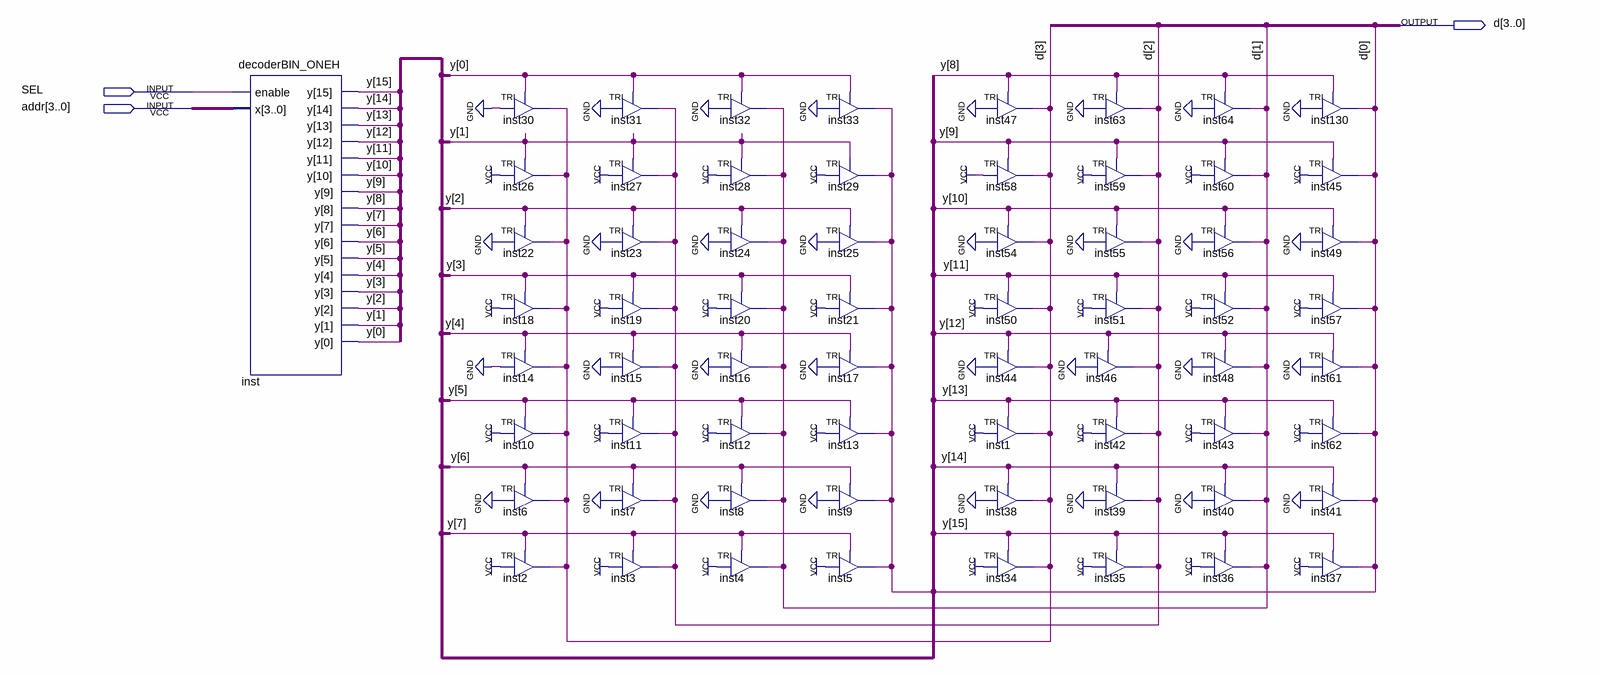
[diagram p0: schematic sheet]
// Quartus schematic rom16x4_0ls.bdf as structural Verilog: 65 symbols, 3 pins
module rom16x4_0ls (
  input  SEL,
  input  [3:0] addr,
  output [3:0] d
);

  wire [15:0] y;

  decoderBIN_ONEH inst (.enable(SEL), .x(addr), .y(y));
  TRI inst30 (.IN(1'b0), .OE(y[0]), .OUT(d[3]));
  TRI inst26 (.IN(1'b1), .OE(y[1]), .OUT(d[3]));
  TRI inst22 (.IN(1'b0), .OE(y[2]), .OUT(d[3]));
  TRI inst18 (.IN(1'b1), .OE(y[3]), .OUT(d[3]));
  TRI inst14 (.IN(1'b0), .OE(y[4]), .OUT(d[3]));
  TRI inst10 (.IN(1'b1), .OE(y[5]), .OUT(d[3]));
  TRI inst6 (.IN(1'b0), .OE(y[6]), .OUT(d[3]));
  TRI inst2 (.IN(1'b1), .OE(y[7]), .OUT(d[3]));
  TRI inst31 (.IN(1'b0), .OE(y[0]), .OUT(d[2]));
  TRI inst27 (.IN(1'b1), .OE(y[1]), .OUT(d[2]));
  TRI inst23 (.IN(1'b0), .OE(y[2]), .OUT(d[2]));
  TRI inst19 (.IN(1'b1), .OE(y[3]), .OUT(d[2]));
  TRI inst15 (.IN(1'b0), .OE(y[4]), .OUT(d[2]));
  TRI inst11 (.IN(1'b1), .OE(y[5]), .OUT(d[2]));
  TRI inst7 (.IN(1'b0), .OE(y[6]), .OUT(d[2]));
  TRI inst3 (.IN(1'b1), .OE(y[7]), .OUT(d[2]));
  TRI inst32 (.IN(1'b0), .OE(y[0]), .OUT(d[1]));
  TRI inst28 (.IN(1'b1), .OE(y[1]), .OUT(d[1]));
  TRI inst24 (.IN(1'b0), .OE(y[2]), .OUT(d[1]));
  TRI inst20 (.IN(1'b1), .OE(y[3]), .OUT(d[1]));
  TRI inst16 (.IN(1'b0), .OE(y[4]), .OUT(d[1]));
  TRI inst12 (.IN(1'b1), .OE(y[5]), .OUT(d[1]));
  TRI inst8 (.IN(1'b0), .OE(y[6]), .OUT(d[1]));
  TRI inst4 (.IN(1'b1), .OE(y[7]), .OUT(d[1]));
  TRI inst33 (.IN(1'b0), .OE(y[0]), .OUT(d[0]));
  TRI inst29 (.IN(1'b1), .OE(y[1]), .OUT(d[0]));
  TRI inst25 (.IN(1'b0), .OE(y[2]), .OUT(d[0]));
  TRI inst21 (.IN(1'b1), .OE(y[3]), .OUT(d[0]));
  TRI inst17 (.IN(1'b0), .OE(y[4]), .OUT(d[0]));
  TRI inst13 (.IN(1'b1), .OE(y[5]), .OUT(d[0]));
  TRI inst9 (.IN(1'b0), .OE(y[6]), .OUT(d[0]));
  TRI inst5 (.IN(1'b1), .OE(y[7]), .OUT(d[0]));
  TRI inst47 (.IN(1'b0), .OE(y[8]), .OUT(d[3]));
  TRI inst58 (.IN(1'b1), .OE(y[9]), .OUT(d[3]));
  TRI inst54 (.IN(1'b0), .OE(y[10]), .OUT(d[3]));
  TRI inst50 (.IN(1'b1), .OE(y[11]), .OUT(d[3]));
  TRI inst44 (.IN(1'b0), .OE(y[12]), .OUT(d[3]));
  TRI inst1 (.IN(1'b1), .OE(y[13]), .OUT(d[3]));
  TRI inst38 (.IN(1'b0), .OE(y[14]), .OUT(d[3]));
  TRI inst34 (.IN(1'b1), .OE(y[15]), .OUT(d[3]));
  TRI inst63 (.IN(1'b0), .OE(y[8]), .OUT(d[2]));
  TRI inst59 (.IN(1'b1), .OE(y[9]), .OUT(d[2]));
  TRI inst55 (.IN(1'b0), .OE(y[10]), .OUT(d[2]));
  TRI inst51 (.IN(1'b1), .OE(y[11]), .OUT(d[2]));
  TRI inst46 (.IN(1'b0), .OE(y[12]), .OUT(d[2]));
  TRI inst42 (.IN(1'b1), .OE(y[13]), .OUT(d[2]));
  TRI inst39 (.IN(1'b0), .OE(y[14]), .OUT(d[2]));
  TRI inst35 (.IN(1'b1), .OE(y[15]), .OUT(d[2]));
  TRI inst64 (.IN(1'b0), .OE(y[8]), .OUT(d[1]));
  TRI inst60 (.IN(1'b1), .OE(y[9]), .OUT(d[1]));
  TRI inst56 (.IN(1'b0), .OE(y[10]), .OUT(d[1]));
  TRI inst52 (.IN(1'b1), .OE(y[11]), .OUT(d[1]));
  TRI inst48 (.IN(1'b0), .OE(y[12]), .OUT(d[1]));
  TRI inst43 (.IN(1'b1), .OE(y[13]), .OUT(d[1]));
  TRI inst40 (.IN(1'b0), .OE(y[14]), .OUT(d[1]));
  TRI inst36 (.IN(1'b1), .OE(y[15]), .OUT(d[1]));
  TRI inst130 (.IN(1'b0), .OE(y[8]), .OUT(d[0]));
  TRI inst45 (.IN(1'b1), .OE(y[9]), .OUT(d[0]));
  TRI inst49 (.IN(1'b0), .OE(y[10]), .OUT(d[0]));
  TRI inst57 (.IN(1'b1), .OE(y[11]), .OUT(d[0]));
  TRI inst61 (.IN(1'b0), .OE(y[12]), .OUT(d[0]));
  TRI inst62 (.IN(1'b1), .OE(y[13]), .OUT(d[0]));
  TRI inst41 (.IN(1'b0), .OE(y[14]), .OUT(d[0]));
  TRI inst37 (.IN(1'b1), .OE(y[15]), .OUT(d[0]));
endmodule
